# Altium project AlarmBJT.PrjPcb
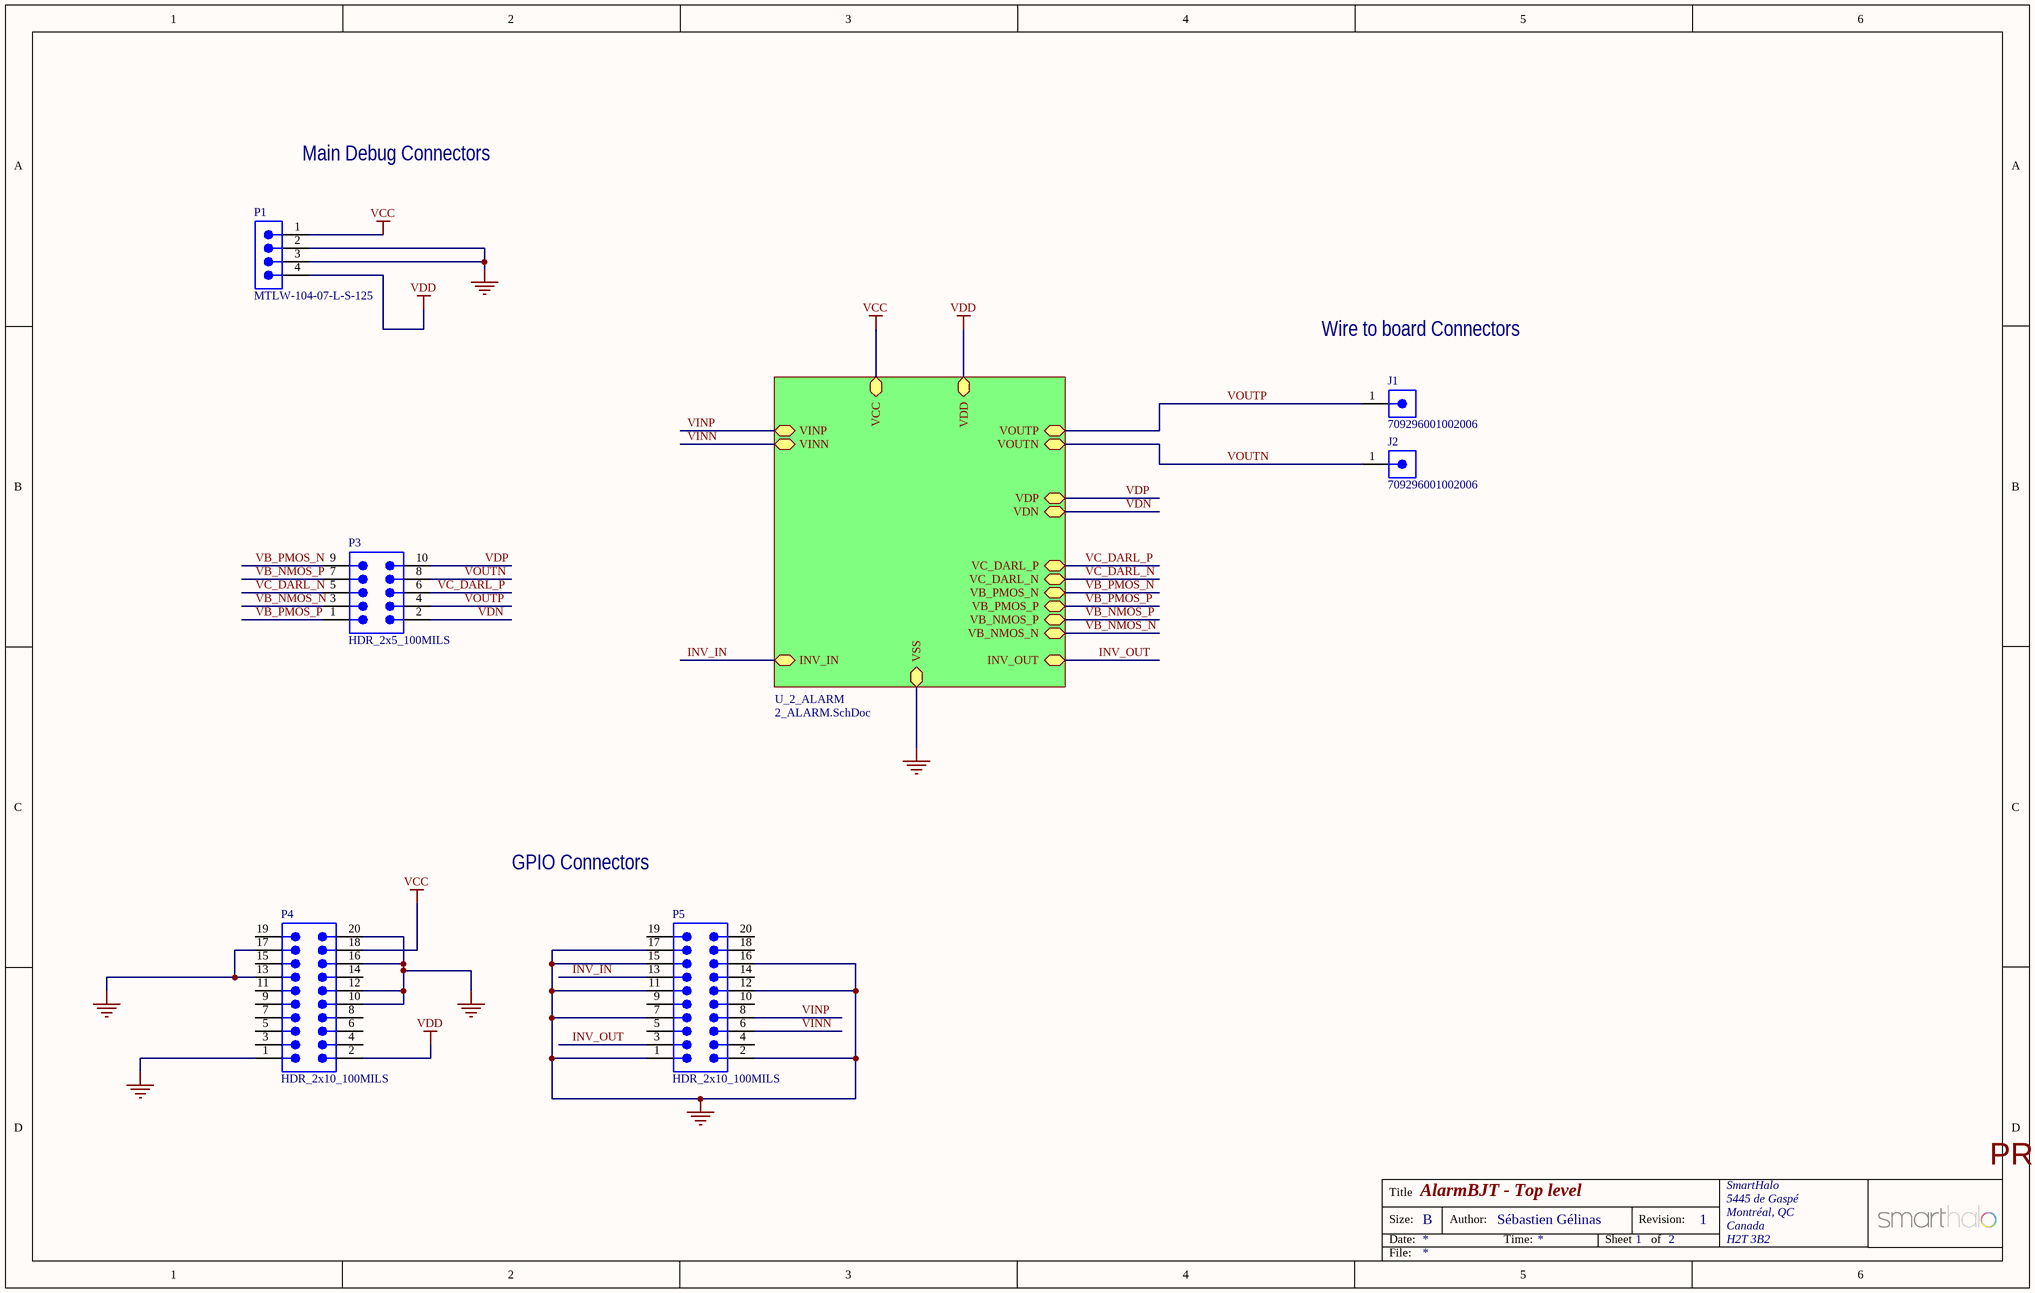
[diagram p0: 1_TOP.SchDoc]
ApprovedBy: Olivier Bourbonnais
2 sheets, 40 parts. Net scope: hierarchical (ports join the sheet entries above them; power ports are global).
Board file: AlarmBJT.PcbDoc
Sheets:
  1_TOP.SchDoc
    U_2_ALARM = 2_ALARM.SchDoc

## Sheet 1_TOP.SchDoc: AlarmBJT - Top level
size B; Author: Sébastien Gélinas; Organization: SmartHalo; Address1: 5445 de Gaspé; Address2: Montréal, QC; Address3: Canada; Address4: H2T 3B2; DocumentNumber: 1; Revision: 1; SheetNumber: 1; SheetTotal: 2

### Parts
J1  709296001002006  [709296001002006]
J2  709296001002006  [709296001002006]
P1  MTLW-104-07-L-S-125  [SMTC-MTLW-104-07-X-S-125]  (no BOM)
P3  HDR_2x5_100MILS  [HDR_2X5_100MILS]  (no BOM)
P4  HDR_2x10_100MILS  [HDR_2X10_100MILS]  (no BOM)
P5  HDR_2x10_100MILS  [HDR_2X10_100MILS]  (no BOM)

### Sub-sheets
U_2_ALARM = 2_ALARM.SchDoc: VDD (bidir), VDP (bidir), VDN (bidir), VC_DARL_P (bidir), VC_DARL_N (bidir), VOUTN (bidir), VOUTP (bidir), VB_PMOS_N (bidir), VB_PMOS_P (bidir), VB_NMOS_P (bidir), VB_NMOS_N (bidir), VINP (bidir), VINN (bidir), VCC (bidir), INV_IN (bidir), INV_OUT (bidir), VSS (bidir)

### Nets
GND: P1.2 P1.3 P4.1 P4.10 P4.12 P4.13 P4.16 P4.17 P4.20 P5.1 P5.2 P5.7 P5.11 P5.12 P5.15 P5.16 P5.17 ; sheet U_2_ALARM/VSS
VCC: P1.1 P4.18 ; sheet U_2_ALARM/VCC
VDD: P1.4 P4.2 ; sheet U_2_ALARM/VDD
INV_IN: P5.13 ; sheet U_2_ALARM/INV_IN
INV_OUT: P5.3 ; sheet U_2_ALARM/INV_OUT
VB_NMOS_N: P3.3 ; sheet U_2_ALARM/VB_NMOS_N
VB_NMOS_P: P3.7 ; sheet U_2_ALARM/VB_NMOS_P
VB_PMOS_N: P3.9 ; sheet U_2_ALARM/VB_PMOS_N
VB_PMOS_P: P3.1 ; sheet U_2_ALARM/VB_PMOS_P
VC_DARL_N: P3.5 ; sheet U_2_ALARM/VC_DARL_N
VC_DARL_P: P3.6 ; sheet U_2_ALARM/VC_DARL_P
VDN: P3.2 ; sheet U_2_ALARM/VDN
VDP: P3.10 ; sheet U_2_ALARM/VDP
VINN: P5.6 ; sheet U_2_ALARM/VINN
VINP: P5.8 ; sheet U_2_ALARM/VINP
VOUTN: J2.1 P3.8 ; sheet U_2_ALARM/VOUTN
VOUTP: J1.1 P3.4 ; sheet U_2_ALARM/VOUTP

Not connected (* = marked no-connect by the designer): P4 3 4 5 6 7 8 9 11 14 15 19; P5 4 5 9 10 14 18 19 20

### Notes on the sheet
- Main Debug Connectors
- Wire to board Connectors
- GPIO Connectors
- PRELIMINARY: DO NOT USE FOR PRODUCTION
- Title
- Size:
- Date:
- B
- Author:
- Time:
- Sheet
- Revision:
- of
- File:

### Library data of the parts
J1 J2 = 709296001002006: Connector, Single Horizontal Contact, 2 x 2 mm; Manufacturer: AVX; Manufacturer Part Number: 709296001002006; Part Number: 709296001002006; Supplier: Arrow Electronics; Footprint Name: CUSTOM(Wire to board connector); Supplier Part Number: *
P1 = SMTC-MTLW-104-07-X-S-125: Low Profile .025" SQ Post Header, Through-hole, Vertical, -55 to 125 degC, 2.54 mm Pitch, 4-Pin, Male, RoHS; Manufacturer: Samtec; Pitch: 2.54 mm; PackageDescription: Low Profile Terminal Assembly; PartNumber: MTLW-104-07-L-S-125; PackageReference: MTLW-104-07-X-S-125; ComponentLink1Description: Manufacturer URL; ComponentLink2Description: Datasheet; ComponentLink2URL: http://www.samtec.com/documents/webfiles/pdf/MTLW_TH.PDF; ComponentLink3Description: Package Specification; Mounting Technology: Through-hole; ComponentLink3URL: http://www.samtec.com/documents/webfiles/cpdf/MTLW-1XX-XX-XX-X-XXX-XX-XX-MKT1.pdf; ComponentLink1URL: http://www.samtec.com; Orientation: Vertical; PackageVersion: T, 6/1991; DatasheetVersion: F-214; Temperature Range: -55 to 125 degC; RoHS: True
P3 = HDR_2x5_100MILS: Header, 100 mils, 2 rows, 10 pins
P4 P5 = HDR_2x10_100MILS: Header, 100 mils, 2 rows, 20 pins

## Sheet 2_ALARM.SchDoc: AlarmBJT - Alarm
size B; Author: Sébastien Gélinas; Organization: SmartHalo; Address1: 5445 de Gaspé; Address2: Montréal, QC; Address3: Canada; Address4: H2T 3B2; DocumentNumber: 1; Revision: 1; SheetNumber: 2; SheetTotal: 2
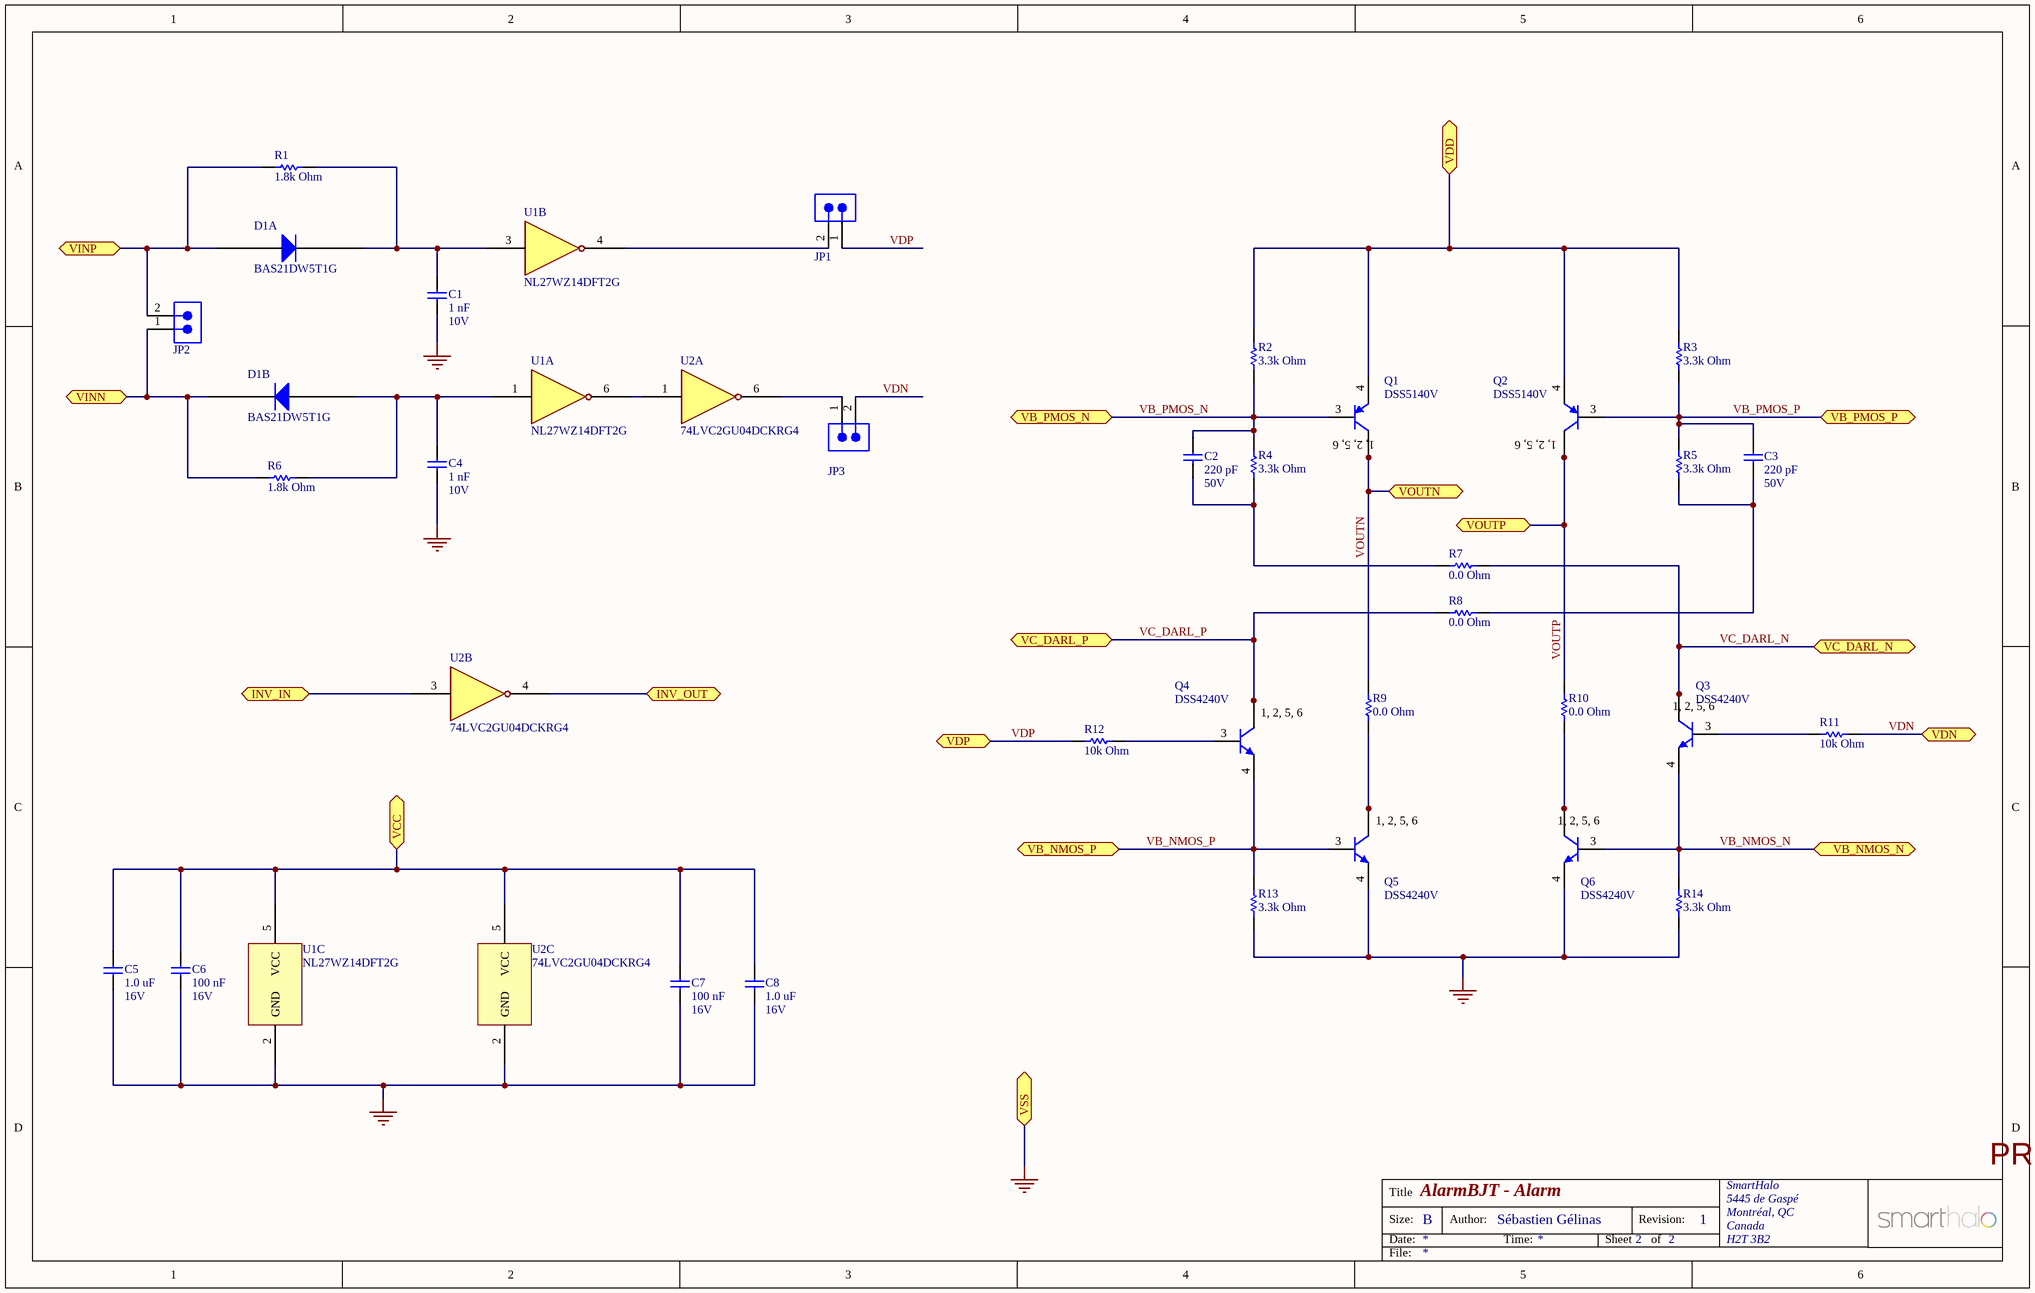
[diagram p1: 2_ALARM.SchDoc]

### Parts
C1  1 nF  Voltage Rating: 10V  [Varitron_CAP0603]
C2  220 pF  Voltage Rating: 50V  [Varitron_CAP0603]
C3  220 pF  Voltage Rating: 50V  [Varitron_CAP0603]
C4  1 nF  Voltage Rating: 10V  [Varitron_CAP0603]
C5  1.0 uF  Voltage Rating: 16V  [Varitron_CAP0603]
C6  100 nF  Voltage Rating: 16V  [Varitron_CAP0603]
C7  100 nF  Voltage Rating: 16V  [Varitron_CAP0603]
C8  1.0 uF  Voltage Rating: 16V  [Varitron_CAP0603]
D1  BAS21DW5T1G  [SC70-5]  (parts A,B of 2)
JP1  JMP_2PINS_100MILS  [HDR_2X1_100MILS]  (value not drawn)  (no BOM)
JP2  JMP_2PINS_100MILS  [HDR_2X1_100MILS]  (value not drawn)  (no BOM)
JP3  JMP_2PINS_100MILS  [HDR_2X1_100MILS]  (value not drawn)  (no BOM)
Q1  DSS5140V  [SOT563]
Q2  DSS5140V  [SOT563]
Q3  DSS4240V  [SOT563]
Q4  DSS4240V  [SOT563]
Q5  DSS4240V  [SOT563]
Q6  DSS4240V  [SOT563]
R1  1.8k Ohm  [Varitron_RES0603]
R2  3.3k Ohm  [Varitron_RES0603]
R3  3.3k Ohm  [Varitron_RES0603]
R4  3.3k Ohm  [Varitron_RES0603]
R5  3.3k Ohm  [Varitron_RES0603]
R6  1.8k Ohm  [Varitron_RES0603]
R7  0.0 Ohm  [Varitron_RES0603]
R8  0.0 Ohm  [Varitron_RES0603]
R9  0.0 Ohm  [Varitron_RES0603]
R10  0.0 Ohm  [Varitron_RES0603]
R11  10k Ohm  [Varitron_RES0603]
R12  10k Ohm  [Varitron_RES0603]
R13  3.3k Ohm  [Varitron_RES0603]
R14  3.3k Ohm  [Varitron_RES0603]
U1  NL27WZ14DFT2G  [SOT363_SC70_6]  (parts A,B,C of 3)
U2  74LVC2GU04DCKRG4  [SOT363_SC70_6]  (parts A,B,C of 3)

### Ports
INV_IN (bidir), INV_OUT (bidir), VB_NMOS_N (bidir), VB_NMOS_P (bidir), VB_PMOS_N (bidir), VB_PMOS_P (bidir), VC_DARL_N (bidir), VC_DARL_P (bidir), VCC (bidir), VDD (bidir), VDN (bidir), VDP (bidir), VINN (bidir), VINP (bidir), VOUTN (bidir), VOUTP (bidir), VSS (bidir)

### Nets
GND: C1.1 C4.1 C5.2 C6.2 C7.2 C8.2 Q5.4(E) Q6.4(E) R13.2 R14.1 U1.2(GND) U2.2(GND) ; port VSS
VCC: C5.1 C6.1 C7.1 C8.1 U1.5(VCC) U2.5(VCC) ; port VCC
VDD: Q1.4(E) Q2.4(E) R2.2 R3.2 ; port VDD
INV_IN: U2.3 ; port INV_IN
INV_OUT: U2.4 ; port INV_OUT
VB_NMOS_N: Q3.4(E) Q6.3(B) R14.2 ; port VB_NMOS_N
VB_NMOS_P: Q4.4(E) Q5.3(B) R13.1 ; port VB_NMOS_P
VB_PMOS_N: C2.2 Q1.3(B) R2.1 R4.2 ; port VB_PMOS_N
VB_PMOS_P: C3.2 Q2.3(B) R3.1 R5.2 ; port VB_PMOS_P
VC_DARL_N: Q3.1(C) Q3.2(C) Q3.5(C) Q3.6(C) R7.1 ; port VC_DARL_N
VC_DARL_P: Q4.1(C) Q4.2(C) Q4.5(C) Q4.6(C) R8.2 ; port VC_DARL_P
VDN: JP3.2 R11.2 ; port VDN
VDP: JP1.1 R12.2 ; port VDP
VINN: D1.4(Cathode) JP2.1 R6.2 ; port VINN
VINP: D1.1(Anode) JP2.2 R1.2 ; port VINP
VOUTN: Q1.1(C) Q1.2(C) Q1.5(C) Q1.6(C) R9.1 ; port VOUTN
VOUTP: Q2.1(C) Q2.2(C) Q2.5(C) Q2.6(C) R10.1 ; port VOUTP
NetC1_2: C1.2 D1.5(Cathode) R1.1 U1.3
NetC2_1: C2.1 R4.1 R7.2
NetC3_1: C3.1 R5.1 R8.1
NetC4_2: C4.2 D1.3(Anode) R6.1 U1.1
NetJP1_2: JP1.2 U1.4
NetJP3_1: JP3.1 U2.6
NetQ3_3: Q3.3(B) R11.1
NetQ4_3: Q4.3(B) R12.1
NetQ5_1: Q5.1(C) Q5.2(C) Q5.5(C) Q5.6(C) R9.2
NetQ6_1: Q6.1(C) Q6.2(C) Q6.5(C) Q6.6(C) R10.2
NetU1_6: U1.6 U2.1

Not connected (* = marked no-connect by the designer): D1 2

### Notes on the sheet
- PRELIMINARY: DO NOT USE FOR PRODUCTION
- Title
- Size:
- Date:
- B
- Author:
- Time:
- Sheet
- Revision:
- of
- File:
- (in symbol DSS4240V) 1, 2, 5, 6
- (in symbol DSS5140V) 1, 2, 5, 6

### Library data of the parts
C1 = Varitron_CAP0603: 1 nF 10V X7R 10% 0603 (1608 Metric)  SMD; Case-EIA: 0603; Case-Metric: 1608; Tolerance: 10%; Technology: SMT; Supplier: Arrow Electronics; Footprint Name: 0603; Value: 1 nF
C2 C3 = Varitron_CAP0603: 220 pF 50V X7R 10% 0603 (1608 Metric)  SMD; Case-EIA: 0603; Case-Metric: 1608; Tolerance: 10%; Technology: SMT; Supplier: Arrow Electronics; Footprint Name: 0603; Value: 220 pF
C4 = Varitron_CAP0603: 1 nF V TEMP TOL% 0603 (1608 Metric)  SMD; Case-EIA: 0603; Case-Metric: 1608; Tolerance: 10%; Technology: SMT; Supplier: Arrow Electronics; Footprint Name: 0603; Value: 1 nF
C5 C8 = Varitron_CAP0603: 1.0 uF 16V X7R 10% 0603 (1608 Metric)  SMD; Case-EIA: 0603; Case-Metric: 1608; Tolerance: 10%; Technology: SMT; Supplier: Arrow Electronics; Footprint Name: 0603; Value: 1.0 uF
C6 = Varitron_CAP0603: 100 nF 16V X7R 10% 0603 (1608 Metric)  SMD; Case-EIA: 0603; Case-Metric: 1608; Tolerance: 5%; Technology: SMT; Supplier: Arrow Electronics; Footprint Name: 0603; Value: 100 nF
C7 = Varitron_CAP0603: 100 nF 16V X7R 10% 0603 (1608 Metric)  SMD; Case-EIA: 0603; Case-Metric: 1608; Tolerance: 10%; Technology: SMT; Supplier: Arrow Electronics; Footprint Name: 0603; Value: 100 nF
D1 = BAS21DW5T1G: High Voltage Switching Diode; Manufacturer: ON Semiconductor; Manufacturer Part Number: BAS21DW5T1G; Part Number: BAS21DW5T1G; Supplier: Arrow Electronics; Footprint Name: SC70-5
JP1-JP3 = JMP_2PINS_100MILS: Jumper, 100 mils, 2 pins
Q1 Q2 = DSS5140V: PNP SMT Transistor, Low VCESAT; Manufacturer: Diodes Inc.; hfe: 300; VBE: -1V; VCESAT: -310 mV; Part Number: DSS5140V; Manufacturer Part Number: DSS5140V; Footprint Name: SOT563
Q3-Q6 = DSS4240V: NPN SMT Transistor, Low VCESAT; Manufacturer: Diodes Inc.; hfe: 300; VBE: 1.1V; VCESAT: 400 mV; Part Number: DSS4240V; Manufacturer Part Number: DSS4240V; Footprint Name: SOT563
R1 R6 = Varitron_RES0603: 1k8 0.063W 5%  0603 (1608 Metric)  SMD; Case-Metric: 1608; Case-EIA: 0603; Tolerance: 5%; Technology: SMT; Power: 0.063W; Supplier: Arrow Electronics; Footprint Name: 0603; Value: 1.8k Ohm
R2-R5 R13 R14 = Varitron_RES0603: 3k3 0.063W 5%  0603 (1608 Metric)  SMD; Case-Metric: 1608; Case-EIA: 0603; Tolerance: 5%; Technology: SMT; Power: 0.063W; Supplier: Arrow Electronics; Footprint Name: 0603; Value: 3.3k Ohm
R7-R10 = Varitron_RES0603: 0R0 0..1W JUMPER  0603 (1608 Metric)  SMD; Case-Metric: 1608; Power: 0.1W; Case-EIA: 0603; Tolerance: JUMPER; Technology: SMT; Supplier: Arrow Electronics; Footprint Name: 0603; Value: 0.0 Ohm
R11 R12 = Varitron_RES0603: 10k 0.063W 5%  0603 (1608 Metric)  SMD; Case-Metric: 1608; Case-EIA: 0603; Tolerance: 5%; Technology: SMT; Power: 0.063W; Supplier: Arrow Electronics; Footprint Name: 0603; Value: 10k Ohm
U1 = NL27WZ14DFT2G: IC Dual Inverter with Schmitt Trigger Inputs; Manufacturer: ON Semiconductor; Manufacturer Part Number: NL27WZ14DFT2G; Part Number: NL27WZ14DFT2G; Supplier: Arrow Electronics; Footprint Name: SOT363
U2 = 74LVC2GU04DCKRG4: Dual Inverter Gate; Manufacturer: Texas Instruments; Manufacturer Part Number: 74LVC2GU04DCKRG4; Part Number: 74LVC2GU04DCKRG4; Supplier: Arrow Electronics; Footprint Name: SOT363

## Nets that join several sheets
GND: 1_TOP (17 pins), 2_ALARM (12 pins)
VCC: 1_TOP (P1.1 P4.18), 2_ALARM (6 pins)
VDD: 1_TOP (P1.4 P4.2), 2_ALARM (Q1.4 Q2.4 R2.2 R3.2)
INV_IN: 1_TOP (P5.13), 2_ALARM (U2.3)
INV_OUT: 1_TOP (P5.3), 2_ALARM (U2.4)
VB_NMOS_N: 1_TOP (P3.3), 2_ALARM (Q3.4 Q6.3 R14.2)
VB_NMOS_P: 1_TOP (P3.7), 2_ALARM (Q4.4 Q5.3 R13.1)
VB_PMOS_N: 1_TOP (P3.9), 2_ALARM (C2.2 Q1.3 R2.1 R4.2)
VB_PMOS_P: 1_TOP (P3.1), 2_ALARM (C3.2 Q2.3 R3.1 R5.2)
VC_DARL_N: 1_TOP (P3.5), 2_ALARM (5 pins)
VC_DARL_P: 1_TOP (P3.6), 2_ALARM (5 pins)
VDN: 1_TOP (P3.2), 2_ALARM (JP3.2 R11.2)
VDP: 1_TOP (P3.10), 2_ALARM (JP1.1 R12.2)
VINN: 1_TOP (P5.6), 2_ALARM (D1.4 JP2.1 R6.2)
VINP: 1_TOP (P5.8), 2_ALARM (D1.1 JP2.2 R1.2)
VOUTN: 1_TOP (J2.1 P3.8), 2_ALARM (5 pins)
VOUTP: 1_TOP (J1.1 P3.4), 2_ALARM (5 pins)